# Altium project 智能锁实践教学平台.PrjPcb
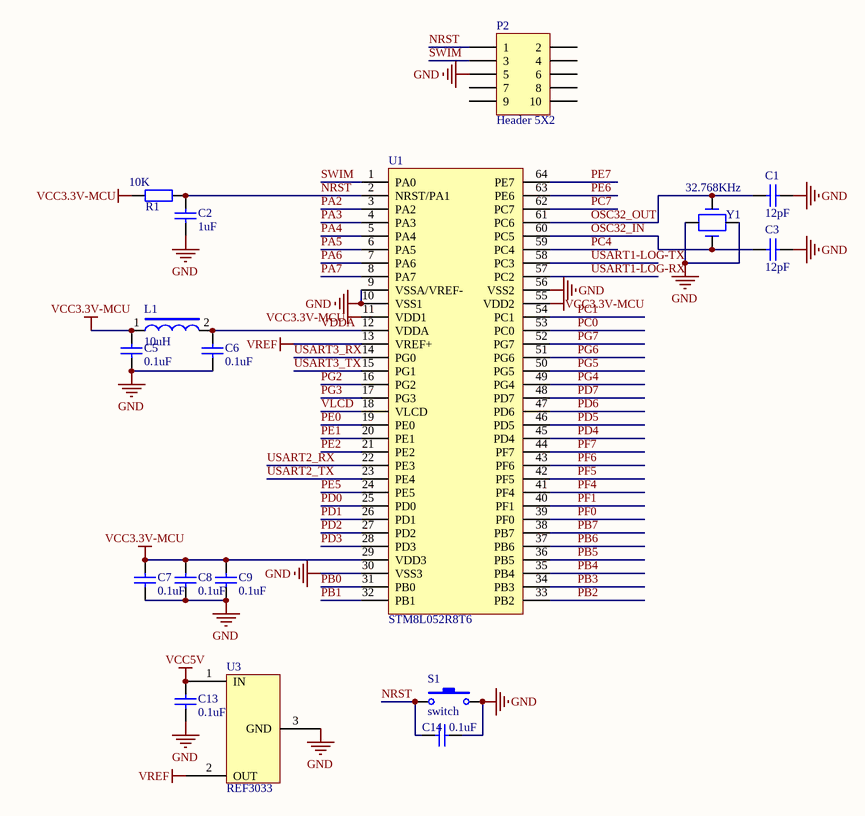
[diagram p0: core.SchDoc]
6 sheets, 194 parts. Net scope: global (net labels, ports and power ports of the same name join across sheets).
Board file: 智能锁实践教学平台.PcbDoc
Sheets:
  core.SchDoc
  interface.SchDoc
  usb.SchDoc
  monitor.SchDoc
  touch.SchDoc
  device.SchDoc

## Sheet core.SchDoc
size A4

### Parts
C1  12pF  [0603_C]
C2  1uF  [0603_C]
C3  12pF  [0603_C]
C5  0.1uF  [0603_C]
C6  0.1uF  [0603_C]
C7  0.1uF  [0603_C]
C8  0.1uF  [0603_C]
C9  0.1uF  [0603_C]
C13  0.1uF  [0603_C]
C14  0.1uF  [0603_C]
L1  10uH  [0603_L]
P2  Header 5X2  [2.54-2*5P简牛]
R1  10K  [0603_R]
S1  switch  [SW-SMD_4P-L6.2-W6.2-P4.50-LS9.0]
U1  STM8L052R8T6  [LQFP-64_10X10X05P]
U3  REF3033  [SOT-23(SOT-23-3)]
Y1  32.768KHz  [CRY_MC146]

### Nets
GND: C1.1 C2.1 C3.1 C5.1 C6.1 C7.1 C8.1 C9.1 C13.1 C14.2 P2.5 S1.2 U1.9(VSSA/VREF-) U1.10(VSS1) U1.30(VSS3) U1.56(VSS2) U3.3(GND) Y1.3 Y1.4
VCC3.3V-MCU: C5.2 C7.2 C8.2 C9.2 L1.1 R1.1 U1.11(VDD1) U1.29(VDD3) U1.55(VDD2)
VCC5V: C13.2 U3.1(IN)
VREF: U1.13(VREF+) U3.2(OUT)
NRST: C2.2 C14.1 P2.1 R1.2 S1.1 U1.2(NRST/PA1)
OSC32_IN: C3.2 U1.60(PC5) Y1.1
OSC32_OUT: C1.2 U1.61(PC6) Y1.2
PA2: U1.3(PA2)
PA3: U1.4(PA3)
PA4: U1.5(PA4)
PA5: U1.6(PA5)
PA6: U1.7(PA6)
PA7: U1.8(PA7)
PB0: U1.31(PB0)
PB1: U1.32(PB1)
PB2: U1.33(PB2)
PB3: U1.34(PB3)
PB4: U1.35(PB4)
PB5: U1.36(PB5)
PB6: U1.37(PB6)
PB7: U1.38(PB7)
PC0: U1.53(PC0)
PC1: U1.54(PC1)
PC4: U1.59(PC4)
PC7: U1.62(PC7)
PD0: U1.25(PD0)
PD1: U1.26(PD1)
PD2: U1.27(PD2)
PD3: U1.28(PD3)
PD4: U1.45(PD4)
PD5: U1.46(PD5)
PD6: U1.47(PD6)
PD7: U1.48(PD7)
PE0: U1.19(PE0)  [project net BiovoV9-INT]
PE1: U1.20(PE1)
PE2: U1.21(PE2)
PE5: U1.24(PE5)
PE6: U1.63(PE6)
PE7: U1.64(PE7)
PF0: U1.39(PF0)
PF1: U1.40(PF1)
PF4: U1.41(PF4)
PF5: U1.42(PF5)
PF6: U1.43(PF6)
PF7: U1.44(PF7)
PG2: U1.16(PG2)
PG3: U1.17(PG3)  [project net F1020-INT]
PG4: U1.49(PG4)
PG5: U1.50(PG5)
PG6: U1.51(PG6)
PG7: U1.52(PG7)
SWIM: P2.3 U1.1(PA0)
USART1-LOG-RX: U1.57(PC2)
USART1-LOG-TX: U1.58(PC3)
USART2_RX: U1.22(PE3)
USART2_TX: U1.23(PE4)
USART3_RX: U1.14(PG0)
USART3_TX: U1.15(PG1)
VDDA: C6.2 L1.2 U1.12(VDDA)
VLCD: U1.18(VLCD)

Not connected (* = marked no-connect by the designer): P2 2 4 6 7 8 9 10

### Library data of the parts
C1-C3 C5-C9 C13 C14 = Cap: 贴片电容，0603
L1 = L: MLZ1608E100MT000，贴片电感，0603
P2 = Header 5X2: 2.54mm 2*5P 直 简牛
R1 = Res2: 贴片电阻，0603
S1 = switch: 贴片按键，6*6*5
U1 = STM8L052R8T6: STM8L052R8T6,LQFP-64_10x10x05P
U3 = REF3033AIDBZR: 3.0V标准电压输出，SOT-23; autor: caibin
Y1 = CRYSTAL_1: OSC,32.768KHz,+/-25ppm,3.3V,15pF,MC146,-20℃~70℃

## Sheet interface.SchDoc
size A4
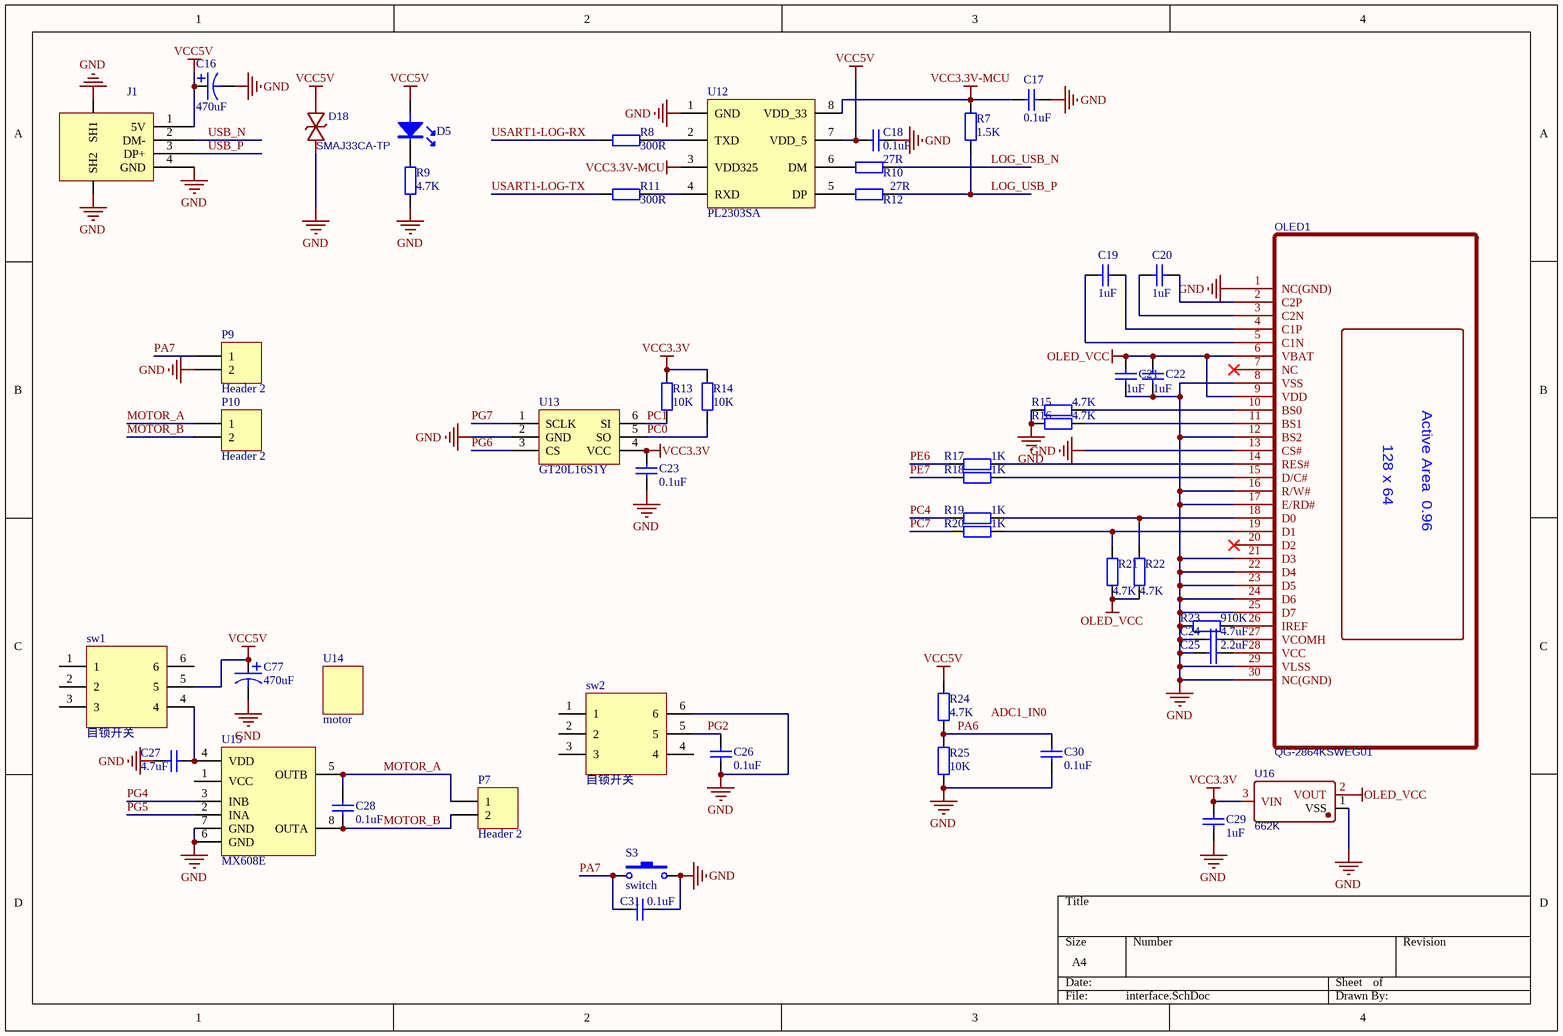
[diagram p1: interface.SchDoc]

### Parts
C16  470uF  [CAP-SMD_BD10.0-L10.3-W10.3-FD]
C17  0.1uF  [0603_C]
C18  0.1uF  [0603_C]
C19  1uF  [0603_C]
C20  1uF  [0603_C]
C21  1uF  [0603_C]
C22  1uF  [0603_C]
C23  0.1uF  [0603_C]
C24  4.7uF  [0603_C]
C25  2.2uF  [0603_C]
C26  0.1uF  [0603_C]
C27  4.7uF  [0603_C]
C28  0.1uF  [0603_C]
C29  1uF  [0603_C]
C30  0.1uF  [0603_C]
C31  0.1uF  [0603_C]
C77  470uF  [CAP-SMD_BD10.0-L10.3-W10.3-FD]
D5  LED  [0603_LED_S1]  (value not drawn)
D18  SMAJ33CA-TP  [SMA_L4.4-W2.6-LS5.0-BI]
J1  USB接口  [USB_D]  (value not drawn)
OLED1  QG-2864KSWEG01  [OLED-SMD_QG-2864KSWEG01-flod]
P7  Header 2  [HDR1X2]
P9  Header 2  [CONN-TH_WJ126V-5.0-2P]
P10  Header 2  [CONN-TH_WJ126V-5.0-2P]
R7  1.5K  [0603_R]
R8  300R  [0603_R]
R9  4.7K  [0603_R]
R10  27R  [0603_R]
R11  300R  [0603_R]
R12  27R  [0603_R]
R13  10K  [0603_R]
R14  10K  [0603_R]
R15  4.7K  [0603_R]
R16  4.7K  [0603_R]
R17  1K  [0603_R]
R18  1K  [0603_R]
R19  1K  [0603_R]
R20  1K  [0603_R]
R21  4.7K  [0603_R]
R22  4.7K  [0603_R]
R23  910K  [0603_R]
R24  4.7K  [0603_R]
R25  10K  [0603_R]
S3  switch  [SW-SMD_4P-L6.2-W6.2-P4.50-LS9.0]
sw1  自锁开关  [SW-TH_6P-L8.5-W8.5-P2.50-LS5.4-BL]
sw2  自锁开关  [SW-TH_6P-L8.5-W8.5-P2.50-LS5.4-BL]
U12  PL2303SA  [SOP-8_150mil]
U13  GT20L16S1Y  [SOT-23-6]
U14  motor  [MH-JS030LK140]
U15  MX608E  [SOP-8_150mil]
U16  662K  [SOT-23(SOT-23-3)]

### Nets
GND: C16.2 C17.1 C18.2 C21.2 C22.2 C23.1 C24.1 C25.1 C26.1 C27.1 C29.2 C30.1 C31.2 C77.2 D18.1 J1.4(GND) J1.SH1 J1.SH2 OLED1.1(NC(GND)) OLED1.8(VSS) OLED1.12(BS2) OLED1.13(CS#) OLED1.16(R/W#) OLED1.17(E/RD#) OLED1.21(D3) OLED1.22(D4) OLED1.23(D5) OLED1.24(D6) OLED1.25(D7) OLED1.29(VLSS) OLED1.30(NC(GND)) P9.2 R9.2 R15.1 R16.1 R23.2 R25.1 S3.2 sw2.6 U12.1(GND) U13.2(GND) U15.6(GND) U15.7(GND) U16.1(VSS)
OLED_VCC: C21.1 C22.1 OLED1.6(VBAT) OLED1.9(VDD) R21.1 R22.1 U16.2(VOUT)
VCC3.3V: C23.2 C29.1 R13.2 R14.2 U13.4(VCC) U16.3(VIN)
VCC3.3V-MCU: C17.2 R7.2 U12.3(VDD325) U12.8(VDD_33)
VCC5V: C16.1 C18.1 C77.1 D5.A D18.2 J1.1(5V) R24.2 sw1.5 U12.7(VDD_5)
LOG_USB_N: R10.2
LOG_USB_P: R7.1 R12.2
MOTOR_A: C28.1 P7.1 P10.1 U15.5(OUTB)
MOTOR_B: C28.2 P7.2 P10.2 U15.8(OUTA)
PA6: C30.2 R24.1 R25.2
PA7: C31.1 P9.1 S3.1
PC0: R14.1 U13.5(SO)
PC1: R13.1 U13.6(SI)
PC4: R19.1
PC7: R20.1
PE6: R17.1
PE7: R18.1
PG2: C26.2 sw2.5
PG4: U15.3(INB)
PG5: U15.2(INA)
PG6: U13.3(CS)
PG7: U13.1(SCLK)
USART1-LOG-RX: R8.1
USART1-LOG-TX: R11.1
USB_N: J1.2(DM-)
USB_P: J1.3(DP+)
NetC19_1: C19.1 OLED1.4(C1P)
NetC19_2: C19.2 OLED1.5(C1N)
NetC20_1: C20.1 OLED1.2(C2P)
NetC20_2: C20.2 OLED1.3(C2N)
NetC24_2: C24.2 OLED1.27(VCOMH)
NetC25_2: C25.2 OLED1.28(VCC)
NetC27_2: C27.2 sw1.4 U15.4(VDD)
NetD5_K: D5.K R9.1
NetOLED1_10: OLED1.10(BS0) R15.2
NetOLED1_11: OLED1.11(BS1) R16.2
NetOLED1_14: OLED1.14(RES#) R17.2
NetOLED1_15: OLED1.15(D/C#) R18.2
NetOLED1_18: OLED1.18(D0) R19.2 R22.2
NetOLED1_19: OLED1.19(D1) R20.2 R21.2
NetOLED1_26: OLED1.26(IREF) R23.1
NetR8_2: R8.2 U12.2(TXD)
NetR10_1: R10.1 U12.6(DM)
NetR11_2: R11.2 U12.4(RXD)
NetR12_1: R12.1 U12.5(DP)

Not connected (* = marked no-connect by the designer): OLED1 7(NC)* 20(D2)*; sw1 1 2 3 6; sw2 1 2 3 4; U15 1(VCC)

### Notes on the sheet
- Labels drawn without touching a wire or pin: ADC1_IN0
- (in symbol QG-2864KSWEG01) Active Area  0.96; 128 x 64

### Library data of the parts
C16 C77 = CAPACITOR: 贴片电容，1206
C17-C31 = Cap: 贴片电容，0603
D5 = LED: 贴片LED，0603，白色
D18 = SMAJ33CA-TP: TVS
J1 = USB: USB-B10-BRW
OLED1 = QG-2864KSWEG01: 128x64 单色白色，QG-2864KSWEG01; BOM_Manufacturer: Allvision; BOM_Supplier: LCSC; BOM_Manufacturer Part: QG-2864KSWEG01; BOM_Supplier Part: C85007; spicePre: O; spiceSymbolName: QG-2864KSWEG01
P7 = Header 2: 不焊; LatestRevisionDate: 17-Jul-2002; LatestRevisionNote: Re-released for DXP Platform.; Publisher: Altium Limited
P9 P10 = Header 2: WJ126V-5.0-2P，不焊
R7-R25 = Res2: 贴片电阻，0603
S3 = switch: 贴片按键，6*6*5
sw1 sw2 = switch_lock: 8.5*8.5*H22.35自锁按键开关
U12 = PL2303SA: USB转TTL芯片，PL2303SA，SOP-8_150mil
U13 = GT20L16S1Y: 字库芯片， SOT-23-6
U14 = motor: 顶呱呱工厂 MH-JS030LK140
U15 = MX608E: MX608E电机驱动，SOP8
U16 = 662K: 线性稳压器662k,SOT23-3

## Sheet usb.SchDoc
size A4
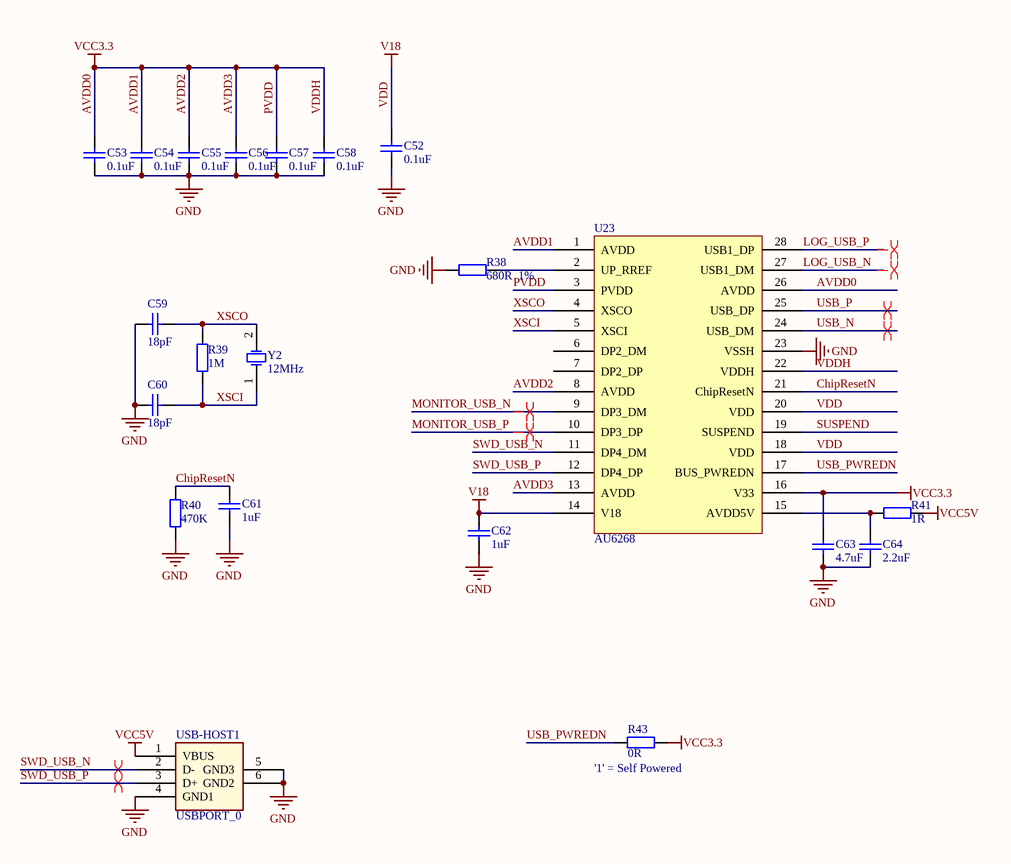
[diagram p2: usb.SchDoc]

### Parts
C52  0.1uF  [0603_C]
C53  0.1uF  [0603_C]
C54  0.1uF  [0603_C]
C55  0.1uF  [0603_C]
C56  0.1uF  [0603_C]
C57  0.1uF  [0603_C]
C58  0.1uF  [0603_C]
C59  18pF  [0603_C]
C60  18pF  [0603_C]
C61  1uF  [0603_C]
C62  1uF  [0603_C]
C63  4.7uF  [0603_C]
C64  2.2uF  [0603_C]
R38  680R  1%  [0603_R]
R39  1M  [0603_R]
R40  470K  [0603_R]
R41  1R  [0603_R]
R43  0R  [0603_R]
U23  AU6268  [SSOP-28_208mil]
USB-HOST1  USBPORT_0  [USB-A-TH_USB-DIP-04F-S1-B1-Y2]
Y2  12MHz  [LC-HC-49SMD]

### Nets
AVDD0: C53.2 C54.2 C55.2 C56.2 C57.2 C58.2 C63.2 R43.1 U23.1(AVDD) U23.3(PVDD) U23.8(AVDD) U23.13(AVDD) U23.16(V33) U23.22(VDDH) U23.26(AVDD)  [also labelled AVDD1, AVDD2, AVDD3, PVDD, VCC3.3, VDDH]
GND: C52.1 C53.1 C54.1 C55.1 C56.1 C57.1 C58.1 C59.2 C60.2 C61.1 C62.1 C63.1 C64.1 R38.1 R40.1 U23.23(VSSH) USB-HOST1.4(GND1) USB-HOST1.5(GND3) USB-HOST1.6(GND2)
VCC5V: R41.2 USB-HOST1.1(VBUS)
VDD: C52.2 C62.2 U23.14(V18) U23.18(VDD) U23.20(VDD)  [also labelled V18]
ChipResetN: C61.2 R40.2 U23.21(ChipResetN)
LOG_USB_N: U23.27(USB1_DM)
LOG_USB_P: U23.28(USB1_DP)
MONITOR_USB_N: U23.9(DP3_DM)
MONITOR_USB_P: U23.10(DP3_DP)
SUSPEND: U23.19(SUSPEND)
SWD_USB_N: U23.11(DP4_DM) USB-HOST1.2(D-)
SWD_USB_P: U23.12(DP4_DP) USB-HOST1.3(D+)
USB_N: U23.24(USB_DM)
USB_P: U23.25(USB_DP)
USB_PWREDN: R43.2 U23.17(BUS_PWREDN)
XSCI: C60.1 R39.1 U23.5(XSCI) Y2.1(OSC1)
XSCO: C59.1 R39.2 U23.4(XSCO) Y2.2(OSC2)
NetC64_2: C64.2 R41.1 U23.15(AVDD5V)
NetR38_2: R38.2 U23.2(UP_RREF)

Not connected (* = marked no-connect by the designer): U23 6(DP2_DM) 7(DP2_DP)

### Layout directives
differential pair: LOG_USB_N, LOG_USB_P, MONITOR_USB_N, MONITOR_USB_P, SWD_USB_N, SWD_USB_P, USB_N, USB_P

### Notes on the sheet
- (near R43) '1' = Self Powered

### Library data of the parts
C52-C64 = Cap: 贴片电容，0603
R38-R41 R43 = Res2: 贴片电阻，0603
U23 = AU6268: AU6268,SSOP28封装
USB-HOST1 = USBPORT_0: USB - A 插座 ,直角,292303-1
Y2 = XTAL: 贴片晶振，49SMD

## Sheet monitor.SchDoc
size A4
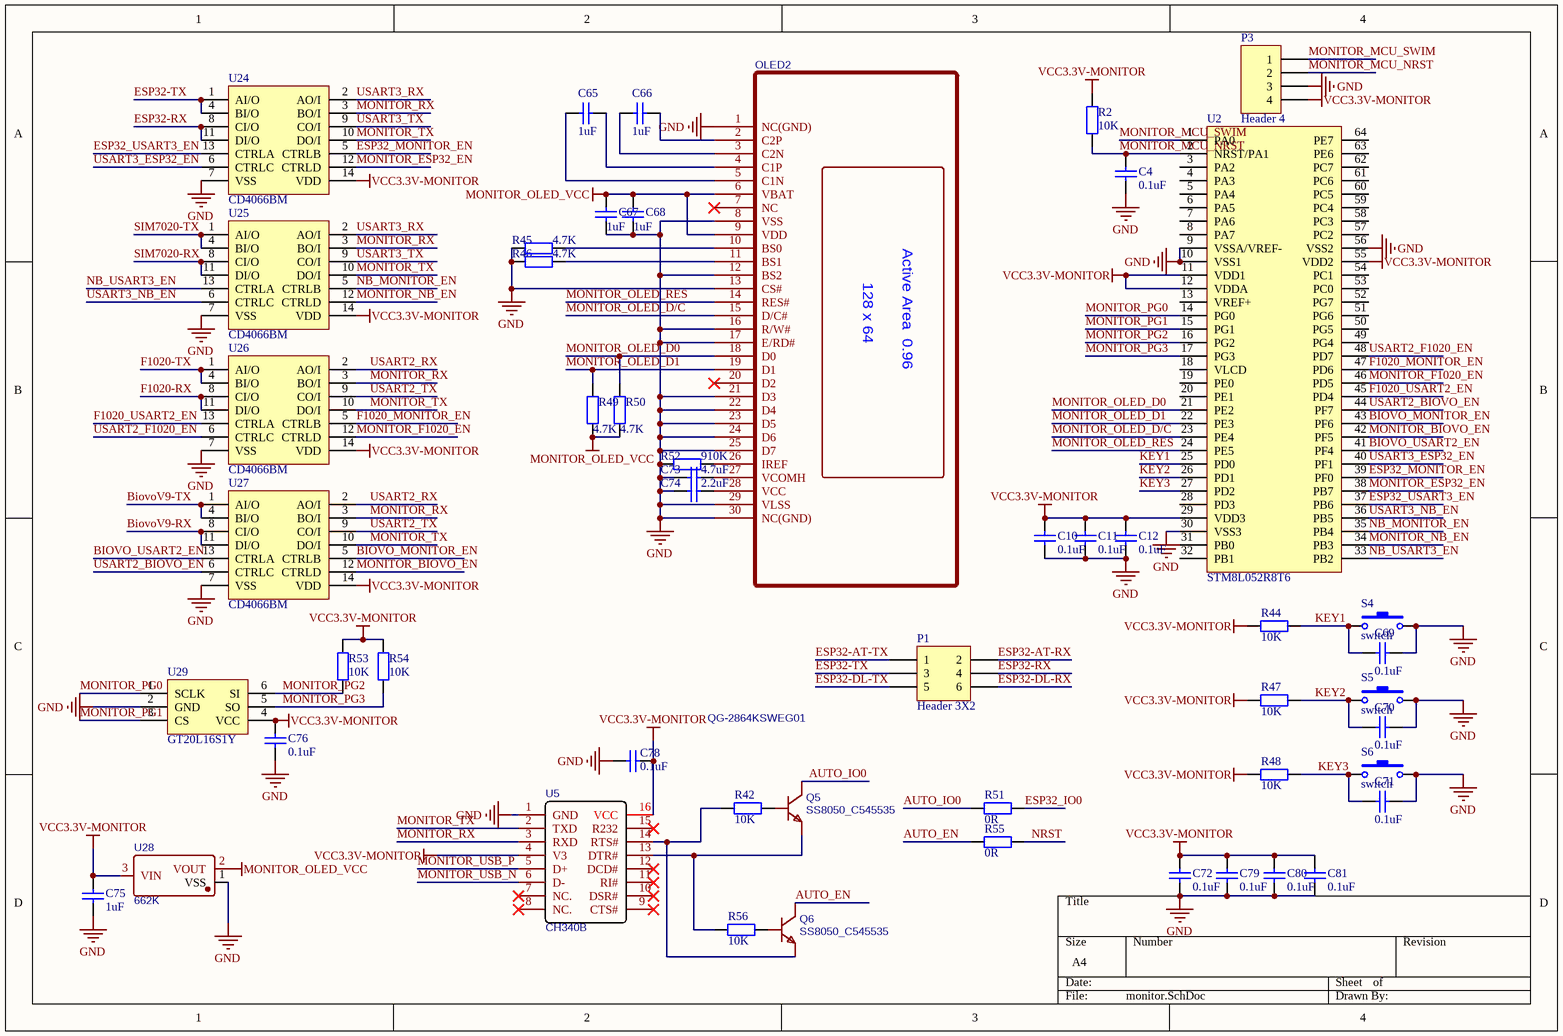
[diagram p3: monitor.SchDoc]

### Parts
C4  0.1uF  [0603_C]
C10  0.1uF  [0603_C]
C11  0.1uF  [0603_C]
C12  0.1uF  [0603_C]
C65  1uF  [0603_C]
C66  1uF  [0603_C]
C67  1uF  [0603_C]
C68  1uF  [0603_C]
C69  0.1uF  [0603_C]
C70  0.1uF  [0603_C]
C71  0.1uF  [0603_C]
C72  0.1uF  [0603_C]
C73  4.7uF  [0603_C]
C74  2.2uF  [0603_C]
C75  1uF  [0603_C]
C76  0.1uF  [0603_C]
C78  0.1uF  [0603_C]
C79  0.1uF  [0603_C]
C80  0.1uF  [0603_C]
C81  0.1uF  [0603_C]
OLED2  QG-2864KSWEG01  [OLED-SMD_QG-2864KSWEG01-flod]
P1  Header 3X2  [HDR2X3]
P3  Header 4  [HDR1X4]
Q5  SS8050_C545535  [SOT-23-3_L2.9-W1.3-P1.90-LS2.4-BR]
Q6  SS8050_C545535  [SOT-23-3_L2.9-W1.3-P1.90-LS2.4-BR]
R2  10K  [0603_R]
R42  10K  [0603_R]
R44  10K  [0603_R]
R45  4.7K  [0603_R]
R46  4.7K  [0603_R]
R47  10K  [0603_R]
R48  10K  [0603_R]
R49  4.7K  [0603_R]
R50  4.7K  [0603_R]
R51  0R  [0603_R]
R52  910K  [0603_R]
R53  10K  [0603_R]
R54  10K  [0603_R]
R55  0R  [0603_R]
R56  10K  [0603_R]
S4  switch  [SW-SMD_4P-L6.2-W6.2-P4.50-LS9.0]
S5  switch  [SW-SMD_4P-L6.2-W6.2-P4.50-LS9.0]
S6  switch  [SW-SMD_4P-L6.2-W6.2-P4.50-LS9.0]
U2  STM8L052R8T6  [LQFP-64_10X10X05P]
U5  CH340B  [SOP-16_L10.0-W3.9-P1.27-LS6.0-BL]
U24  CD4066BM  [SOIC-14_L8.7-W3.9-P1.27-LS6.0-BL]
U25  CD4066BM  [SOIC-14_L8.7-W3.9-P1.27-LS6.0-BL]
U26  CD4066BM  [SOIC-14_L8.7-W3.9-P1.27-LS6.0-BL]
U27  CD4066BM  [SOIC-14_L8.7-W3.9-P1.27-LS6.0-BL]
U28  662K  [SOT-23(SOT-23-3)]
U29  GT20L16S1Y  [SOT-23-6]

### Nets
GND: C4.1 C10.1 C11.1 C12.1 C67.2 C68.2 C69.1 C70.1 C71.1 C72.1 C73.1 C74.1 C75.2 C76.1 C78.1 C79.1 C80.1 C81.1 OLED2.1(NC(GND)) OLED2.8(VSS) OLED2.12(BS2) OLED2.13(CS#) OLED2.16(R/W#) OLED2.17(E/RD#) OLED2.21(D3) OLED2.22(D4) OLED2.23(D5) OLED2.24(D6) OLED2.25(D7) OLED2.29(VLSS) OLED2.30(NC(GND)) P3.3 R45.1 R46.1 R52.2 S4.2 S5.2 S6.2 U2.9(VSSA/VREF-) U2.10(VSS1) U2.30(VSS3) U2.56(VSS2) U5.1(GND) U24.7(VSS) U25.7(VSS) U26.7(VSS) U27.7(VSS) U28.1(VSS) U29.2(GND)
MONITOR_OLED_VCC: C67.1 C68.1 OLED2.6(VBAT) OLED2.9(VDD) R49.1 R50.1 U28.2(VOUT)
VCC3.3V-MONITOR: C10.2 C11.2 C12.2 C72.2 C75.1 C76.2 C78.2 C79.2 C80.2 C81.2 P3.4 R2.2 R44.2 R47.2 R48.2 R53.2 R54.2 U2.11(VDD1) U2.12(VDDA) U2.29(VDD3) U2.55(VDD2) U5.4(V3) U5.16(VCC) U24.14(VDD) U25.14(VDD) U26.14(VDD) U27.14(VDD) U28.3(VIN) U29.4(VCC)
AUTO_EN: Q6.3(C) R55.2
AUTO_IO0: Q5.3(C) R51.2
BIOVO_MONITOR_EN: U2.43(PF6) U27.5(CTRLB)
BIOVO_USART2_EN: U2.41(PF4) U27.13(CTRLA)
BiovoV9-RX: U27.8(CI/O) U27.11(DI/O)
BiovoV9-TX: U27.1(AI/O) U27.4(BI/O)
ESP32-AT-RX: P1.2
ESP32-AT-TX: P1.1
ESP32-DL-RX: P1.6
ESP32-DL-TX: P1.5
ESP32-RX: P1.4 U24.8(CI/O) U24.11(DI/O)
ESP32-TX: P1.3 U24.1(AI/O) U24.4(BI/O)
ESP32_IO0: R51.1
ESP32_MONITOR_EN: U2.39(PF0) U24.5(CTRLB)
ESP32_USART3_EN: U2.37(PB6) U24.13(CTRLA)
F1020-RX: U26.8(CI/O) U26.11(DI/O)
F1020-TX: U26.1(AI/O) U26.4(BI/O)
F1020_MONITOR_EN: U2.47(PD6) U26.5(CTRLB)
F1020_USART2_EN: U2.45(PD4) U26.13(CTRLA)
KEY1: C69.2 R44.1 S4.1 U2.25(PD0)
KEY2: C70.2 R47.1 S5.1 U2.26(PD1)
KEY3: C71.2 R48.1 S6.1 U2.27(PD2)
MONITOR_BIOVO_EN: U2.42(PF5) U27.12(CTRLD)
MONITOR_ESP32_EN: U2.38(PB7) U24.12(CTRLD)
MONITOR_F1020_EN: U2.46(PD5) U26.12(CTRLD)
MONITOR_MCU_NRST: C4.2 P3.2 R2.1 U2.2(NRST/PA1)
MONITOR_MCU_SWIM: P3.1 U2.1(PA0)
MONITOR_NB_EN: U2.34(PB3) U25.12(CTRLD)
MONITOR_OLED_D0: OLED2.18(D0) R50.2 U2.21(PE2)
MONITOR_OLED_D1: OLED2.19(D1) R49.2 U2.22(PE3)
MONITOR_OLED_D/C: OLED2.15(D/C#) U2.23(PE4)
MONITOR_OLED_RES: OLED2.14(RES#) U2.24(PE5)
MONITOR_PG0: U2.14(PG0) U29.1(SCLK)
MONITOR_PG1: U2.15(PG1) U29.3(CS)
MONITOR_PG2: R53.1 U2.16(PG2) U29.6(SI)
MONITOR_PG3: R54.1 U2.17(PG3) U29.5(SO)
MONITOR_RX: U5.3(RXD) U24.3(BO/I) U25.3(BO/I) U26.3(BO/I) U27.3(BO/I)
MONITOR_TX: U5.2(TXD) U24.10(DO/I) U25.10(DO/I) U26.10(DO/I) U27.10(DO/I)
MONITOR_USB_N: U5.6(D-)
MONITOR_USB_P: U5.5(D+)
NB_MONITOR_EN: U2.35(PB4) U25.5(CTRLB)
NB_USART3_EN: U2.33(PB2) U25.13(CTRLA)
NRST: R55.1
SIM7020-RX: U25.8(CI/O) U25.11(DI/O)
SIM7020-TX: U25.1(AI/O) U25.4(BI/O)
USART2_BIOVO_EN: U2.44(PF7) U27.6(CTRLC)
USART2_F1020_EN: U2.48(PD7) U26.6(CTRLC)
USART2_RX: U26.2(AO/I) U27.2(AO/I)
USART2_TX: U26.9(CO/I) U27.9(CO/I)
USART3_ESP32_EN: U2.40(PF1) U24.6(CTRLC)
USART3_NB_EN: U2.36(PB5) U25.6(CTRLC)
USART3_RX: U24.2(AO/I) U25.2(AO/I)
USART3_TX: U24.9(CO/I) U25.9(CO/I)
NetC65_1: C65.1 OLED2.4(C1P)
NetC65_2: C65.2 OLED2.5(C1N)
NetC66_1: C66.1 OLED2.2(C2P)
NetC66_2: C66.2 OLED2.3(C2N)
NetC73_2: C73.2 OLED2.27(VCOMH)
NetC74_2: C74.2 OLED2.28(VCC)
NetOLED2_10: OLED2.10(BS0) R45.2
NetOLED2_11: OLED2.11(BS1) R46.2
NetOLED2_26: OLED2.26(IREF) R52.1
NetQ5_1: Q5.1(B) R42.1
NetQ5_2: Q5.2(E) R56.2 U5.13(DTR#)
NetQ6_1: Q6.1(B) R56.1
NetQ6_2: Q6.2(E) R42.2 U5.14(RTS#)

Not connected (* = marked no-connect by the designer): OLED2 7(NC)* 20(D2)*; U2 3(PA2) 4(PA3) 5(PA4) 6(PA5) 7(PA6) 8(PA7) 13(VREF+) 18(VLCD) 19(PE0) 20(PE1) 28(PD3) 31(PB0) 32(PB1) 49(PG4) 50(PG5) 51(PG6) 52(PG7) 53(PC0) 54(PC1) 57(PC2) 58(PC3) 59(PC4) 60(PC5) 61(PC6) 62(PC7) 63(PE6) 64(PE7); U5 7(NC.)* 8(NC.)* 9(CTS#)* 10(DSR#)* 11(RI#)* 12(DCD#)* 15(R232)*

### Notes on the sheet
- (in symbol QG-2864KSWEG01) Active Area  0.96; 128 x 64

### Library data of the parts
C4 C10-C12 C65-C76 C78-C81 = Cap: 贴片电容，0603
OLED2 = QG-2864KSWEG01: as OLED1 on sheet interface; BOM_Supplier: LCSC; BOM_Manufacturer Part: QG-2864KSWEG01; BOM_Supplier Part: C85007; spicePre: O; spiceSymbolName: QG-2864KSWEG01
P1 = Header 3X2: Header, 3-Pin, Dual row; LatestRevisionDate: 17-Jul-2002; LatestRevisionNote: Re-released for DXP Platform.; Publisher: Altium Limited
P3 = Header 4: 不焊; LatestRevisionDate: 17-Jul-2002; LatestRevisionNote: Re-released for DXP Platform.; Publisher: Altium Limited
Q5 Q6 = SS8050_C545535: S8050,SOT-23
R2 R42 R44-R56 = Res2: 贴片电阻，0603
S4-S6 = switch: 贴片按键，6*6*5
U2 = STM8L052R8T6: STM8L052R8T6,LQFP-64_10x10x05P
U5 = CH340C: CH340B,SOP-16_150mil
U24-U27 = CD4066B: 双向 FET 开关,CD4066BM,SOIC-14
U28 = 662K: 线性稳压器662k,SOT23-3
U29 = GT20L16S1Y: 字库芯片， SOT-23-6

## Sheet touch.SchDoc
size A4
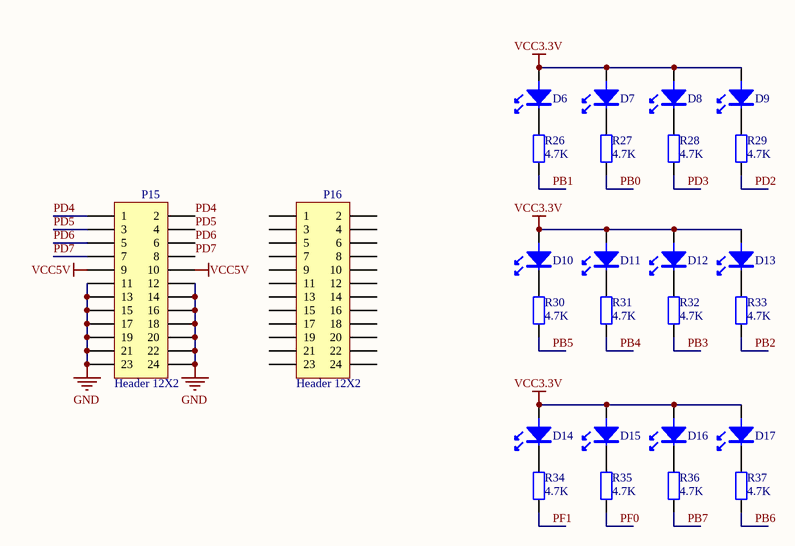
[diagram p4: touch.SchDoc]

### Parts
D6  LED  [0603_LED_S1]  (value not drawn)
D7  LED  [0603_LED_S1]  (value not drawn)
D8  LED  [0603_LED_S1]  (value not drawn)
D9  LED  [0603_LED_S1]  (value not drawn)
D10  LED  [0603_LED_S1]  (value not drawn)
D11  LED  [0603_LED_S1]  (value not drawn)
D12  LED  [0603_LED_S1]  (value not drawn)
D13  LED  [0603_LED_S1]  (value not drawn)
D14  LED  [0603_LED_S1]  (value not drawn)
D15  LED  [0603_LED_S1]  (value not drawn)
D16  LED  [0603_LED_S1]  (value not drawn)
D17  LED  [0603_LED_S1]  (value not drawn)
P15  Header 12X2  [2.0mm 2*12P直排母]
P16  Header 12X2  [2.0mm 2*12P直排母]
R26  4.7K  [0603_R]
R27  4.7K  [0603_R]
R28  4.7K  [0603_R]
R29  4.7K  [0603_R]
R30  4.7K  [0603_R]
R31  4.7K  [0603_R]
R32  4.7K  [0603_R]
R33  4.7K  [0603_R]
R34  4.7K  [0603_R]
R35  4.7K  [0603_R]
R36  4.7K  [0603_R]
R37  4.7K  [0603_R]

### Nets
GND: P15.11 P15.12 P15.13 P15.14 P15.15 P15.16 P15.17 P15.18 P15.19 P15.20 P15.21 P15.22 P15.23 P15.24
VCC3.3V: D6.A D7.A D8.A D9.A D10.A D11.A D12.A D13.A D14.A D15.A D16.A D17.A
VCC5V: P15.9 P15.10
PB0: R27.1
PB1: R26.1
PB2: R33.1
PB3: R32.1
PB4: R31.1
PB5: R30.1
PB6: R37.1
PB7: R36.1
PD2: R29.1
PD3: R28.1
PD4: P15.1 P15.2
PD5: P15.3 P15.4
PD6: P15.5 P15.6
PD7: P15.7 P15.8
PF0: R35.1
PF1: R34.1
NetD6_K: D6.K R26.2
NetD7_K: D7.K R27.2
NetD8_K: D8.K R28.2
NetD9_K: D9.K R29.2
NetD10_K: D10.K R30.2
NetD11_K: D11.K R31.2
NetD12_K: D12.K R32.2
NetD13_K: D13.K R33.2
NetD14_K: D14.K R34.2
NetD15_K: D15.K R35.2
NetD16_K: D16.K R36.2
NetD17_K: D17.K R37.2

Not connected (* = marked no-connect by the designer): P16 1 2 3 4 5 6 7 8 9 10 11 12 13 14 15 16 17 18 19 20 21 22 23 24

### Library data of the parts
D6-D17 = LED: 贴片LED，0603，白色
P15 P16 = Header 12X2: Header, 12-Pin, Dual row; LatestRevisionDate: 17-Jul-2002; LatestRevisionNote: Re-released for DXP Platform.; Publisher: Altium Limited
R26-R37 = Res2: 贴片电阻，0603

## Sheet device.SchDoc
size A4
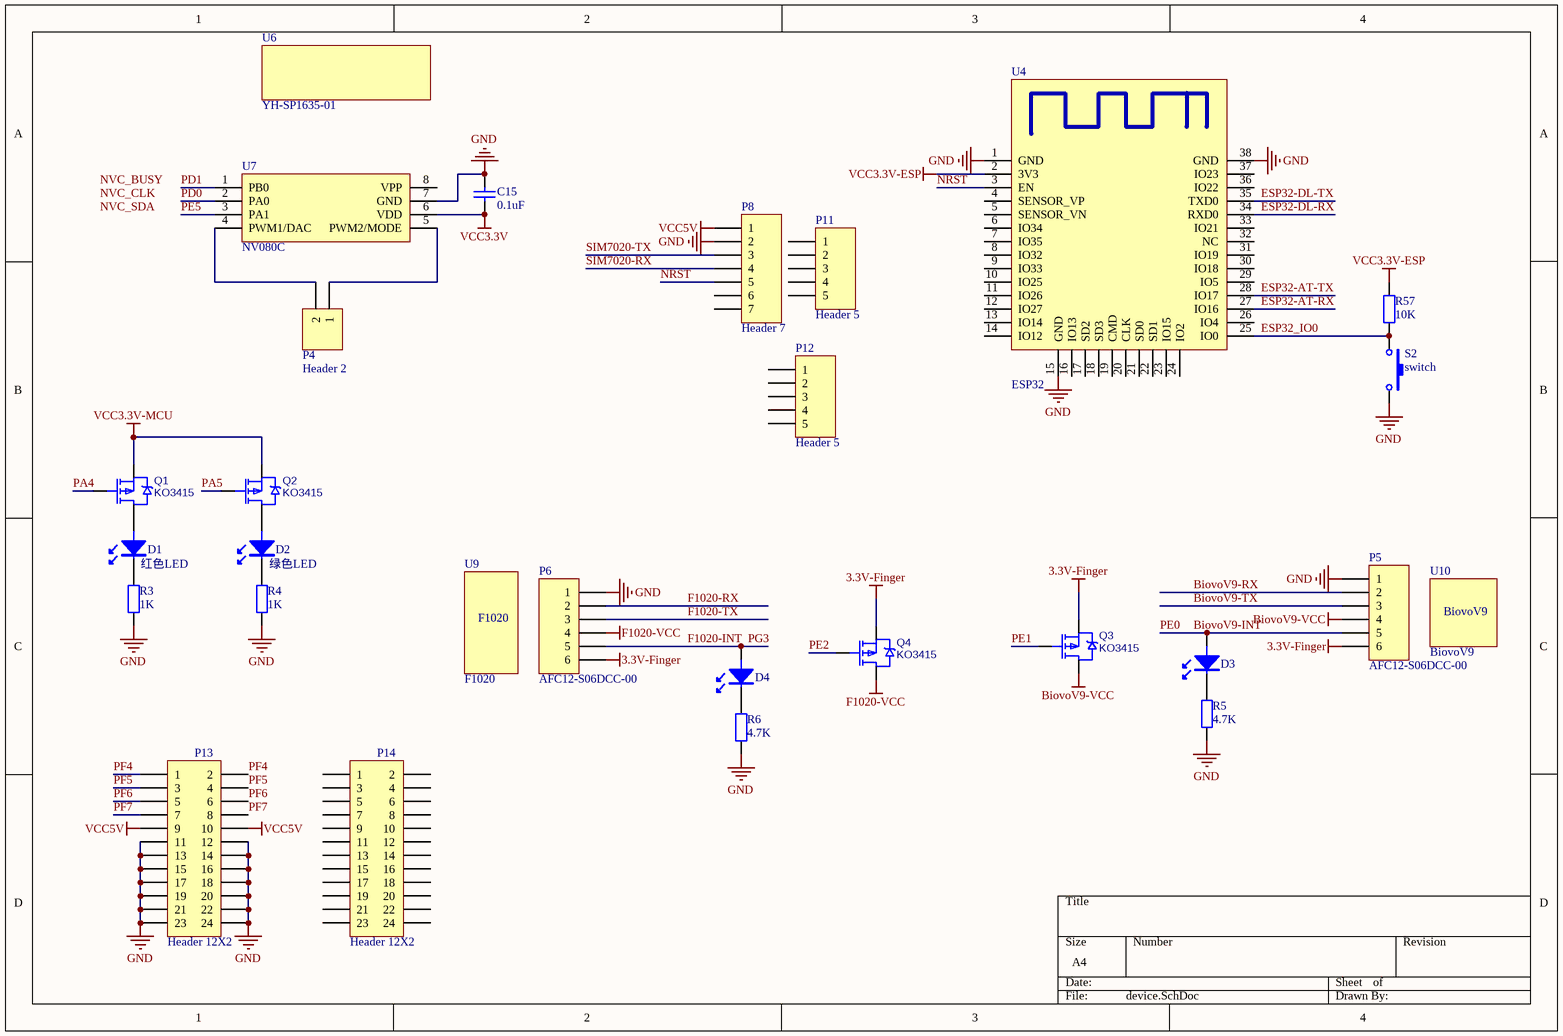
[diagram p5: device.SchDoc]

### Parts
C15  0.1uF  [0603_C]
D1  红色LED  [LED_1206]
D2  绿色LED  [LED_1206]
D3  LED  [0603_LED_S1]  (value not drawn)
D4  LED  [0603_LED_S1]  (value not drawn)
P4  Header 2  [HDR1X2]
P5  AFC12-S06DCC-00  [CONN-SMD_6PIN_AFC12-S06DCC-00_PITCH1.25-L]
P6  AFC12-S06DCC-00  [CONN-SMD_6PIN_AFC12-S06DCC-00_PITCH1.25-L]
P8  Header 7  [HDR1X7]
P11  Header 5  [HDR1X5]
P12  Header 5  [HDR1X5]
P13  Header 12X2  [2.0mm 2*12P直排母]
P14  Header 12X2  [2.0mm 2*12P直排母]
Q1  KO3415  [SOT-23(SOT-23-3)]
Q2  KO3415  [SOT-23(SOT-23-3)]
Q3  KO3415  [SOT-23(SOT-23-3)]
Q4  KO3415  [SOT-23(SOT-23-3)]
R3  1K  [0603_R]
R4  1K  [0603_R]
R5  4.7K  [0603_R]
R6  4.7K  [0603_R]
R57  10K  [0603_R]
S2  switch  [SW-SMD_4P-L6.2-W6.2-P4.50-LS9.0]
U4  ESP32  [WIFIM-SMD_ESP32-S32MB]
U6  YH-SP1635-01  [YH-SP1635-01]
U7  NV080C  [SOP-8_150mil]
U9  F1020  [F1020]
U10  BiovoV9  [BiovoV9]

### Nets
3.3V-Finger: P5.6 P6.6 Q3.2(S) Q4.2(S)
BiovoV9-VCC: P5.4 Q3.3(D)
F1020-VCC: P6.4 Q4.3(D)
GND: C15.2 P5.1 P6.1 P8.2 P13.11 P13.12 P13.13 P13.14 P13.15 P13.16 P13.17 P13.18 P13.19 P13.20 P13.21 P13.22 P13.23 P13.24 R3.1 R4.1 R5.1 R6.1 S2.2 U4.1(GND) U4.15(GND) U4.38(GND) U7.7(GND)
VCC3.3V: C15.1 U7.6(VDD)
VCC3.3V-ESP: R57.2 U4.2(3V3)
VCC3.3V-MCU: Q1.2(S) Q2.2(S)
VCC5V: P8.1 P13.9 P13.10
BiovoV9-INT: D3.A P5.5  [also labelled PE0]
BiovoV9-RX: P5.2
BiovoV9-TX: P5.3
ESP32-AT-RX: U4.27(IO16)
ESP32-AT-TX: U4.28(IO17)
ESP32-DL-RX: U4.34(RXD0)
ESP32-DL-TX: U4.35(TXD0)
ESP32_IO0: R57.1 S2.1 U4.25(IO0)
F1020-INT: D4.A P6.5  [also labelled PG3]
F1020-RX: P6.2
F1020-TX: P6.3
NRST: P8.5 U4.3(EN)
PA4: Q1.1(G)
PA5: Q2.1(G)
PD0: U7.2(PA0)
PD1: U7.1(PB0)
PE1: Q3.1(G)
PE2: Q4.1(G)
PE5: U7.3(PA1)
PF4: P13.1 P13.2
PF5: P13.3 P13.4
PF6: P13.5 P13.6
PF7: P13.7 P13.8
SIM7020-RX: P8.4
SIM7020-TX: P8.3
NetD1_A: D1.A Q1.3(D)
NetD1_K: D1.K R3.2
NetD2_A: D2.A Q2.3(D)
NetD2_K: D2.K R4.2
NetD3_K: D3.K R5.2
NetD4_K: D4.K R6.2
NetP4_1: P4.1 U7.5(PWM2/MODE)
NetP4_2: P4.2 U7.4(PWM1/DAC)

Not connected (* = marked no-connect by the designer): P8 6 7; P11 1 2 3 4 5; P12 1 2 3 4 5; P14 1 2 3 4 5 6 7 8 9 10 11 12 13 14 15 16 17 18 19 20 21 22 23 24; U4 4(SENSOR_VP) 5(SENSOR_VN) 6(IO34) 7(IO35) 8(IO32) 9(IO33) 10(IO25) 11(IO26) 12(IO27) 13(IO14) 14(IO12) 16(IO13) 17(SD2) 18(SD3) 19(CMD) 20(CLK) 21(SD0) 22(SD1) 23(IO15) 24(IO2) 26(IO4) 29(IO5) 30(IO18) 31(IO19) 32(NC) 33(IO21) 36(IO22) 37(IO23); U7 8(VPP)

### Notes on the sheet
- Labels drawn without touching a wire or pin: NVC_BUSY, NVC_CLK, NVC_SDA

### Library data of the parts
C15 = Cap: 贴片电容，0603
D1 = LED: 1206封装，红色LED
D2 = LED: 1206封装，绿色LED
D3 D4 = LED: 贴片LED，0603，白色
P4 = Header 2: 不焊; LatestRevisionDate: 17-Jul-2002; LatestRevisionNote: Re-released for DXP Platform.; Publisher: Altium Limited
P5 P6 = Header 6: 1.25MM 6P 卧式贴片插座连接器
P8 = Header 7: Header, 7-Pin; LatestRevisionDate: 17-Jul-2002; LatestRevisionNote: Re-released for DXP Platform.; Publisher: Altium Limited
P11 P12 = Header 5: Header, 5-Pin; LatestRevisionDate: 17-Jul-2002; LatestRevisionNote: Re-released for DXP Platform.; Publisher: Altium Limited
P13 P14 = Header 12X2: Header, 12-Pin, Dual row; LatestRevisionDate: 17-Jul-2002; LatestRevisionNote: Re-released for DXP Platform.; Publisher: Altium Limited
Q1-Q4 = 3415: KO3415,SOT23-3
R3-R6 R57 = Res2: 贴片电阻，0603
S2 = switch: 贴片按键，6*6*5
U6 = speaker: 1635腔体喇叭，不焊
U7 = NVCXXXC: 语音芯片，SOP-8
U9 = F1020: 不焊
U10 = BiovoV9: 不焊

## Nets that join several sheets
GND: core (19 pins), interface (44 pins), usb (19 pins), monitor (49 pins), touch (14 pins), device (27 pins)
VCC3.3V: interface (6 pins), touch (12 pins), device (C15.1 U7.6)
VCC3.3V-MCU: core (9 pins), interface (C17.2 R7.2 U12.3 U12.8), device (Q1.2 Q2.2)
VCC5V: core (C13.2 U3.1), interface (9 pins), usb (R41.2 USB-HOST1.1), touch (P15.9 P15.10), device (P8.1 P13.9 P13.10)
BiovoV9-INT: core (U1.19), device (D3.A P5.5)
BiovoV9-RX: monitor (U27.8 U27.11), device (P5.2)
BiovoV9-TX: monitor (U27.1 U27.4), device (P5.3)
ESP32-AT-RX: monitor (P1.2), device (U4.27)
ESP32-AT-TX: monitor (P1.1), device (U4.28)
ESP32-DL-RX: monitor (P1.6), device (U4.34)
ESP32-DL-TX: monitor (P1.5), device (U4.35)
ESP32_IO0: monitor (R51.1), device (R57.1 S2.1 U4.25)
F1020-INT: core (U1.17), device (D4.A P6.5)
F1020-RX: monitor (U26.8 U26.11), device (P6.2)
F1020-TX: monitor (U26.1 U26.4), device (P6.3)
LOG_USB_N: interface (R10.2), usb (U23.27)
LOG_USB_P: interface (R7.1 R12.2), usb (U23.28)
MONITOR_USB_N: usb (U23.9), monitor (U5.6)
MONITOR_USB_P: usb (U23.10), monitor (U5.5)
NRST: core (6 pins), monitor (R55.1), device (P8.5 U4.3)
PA4: core (U1.5), device (Q1.1)
PA5: core (U1.6), device (Q2.1)
PA6: core (U1.7), interface (C30.2 R24.1 R25.2)
PA7: core (U1.8), interface (C31.1 P9.1 S3.1)
PB0: core (U1.31), touch (R27.1)
PB1: core (U1.32), touch (R26.1)
PB2: core (U1.33), touch (R33.1)
PB3: core (U1.34), touch (R32.1)
PB4: core (U1.35), touch (R31.1)
PB5: core (U1.36), touch (R30.1)
PB6: core (U1.37), touch (R37.1)
PB7: core (U1.38), touch (R36.1)
PC0: core (U1.53), interface (R14.1 U13.5)
PC1: core (U1.54), interface (R13.1 U13.6)
PC4: core (U1.59), interface (R19.1)
PC7: core (U1.62), interface (R20.1)
PD0: core (U1.25), device (U7.2)
PD1: core (U1.26), device (U7.1)
PD2: core (U1.27), touch (R29.1)
PD3: core (U1.28), touch (R28.1)
PD4: core (U1.45), touch (P15.1 P15.2)
PD5: core (U1.46), touch (P15.3 P15.4)
PD6: core (U1.47), touch (P15.5 P15.6)
PD7: core (U1.48), touch (P15.7 P15.8)
PE1: core (U1.20), device (Q3.1)
PE2: core (U1.21), device (Q4.1)
PE5: core (U1.24), device (U7.3)
PE6: core (U1.63), interface (R17.1)
PE7: core (U1.64), interface (R18.1)
PF0: core (U1.39), touch (R35.1)
PF1: core (U1.40), touch (R34.1)
PF4: core (U1.41), device (P13.1 P13.2)
PF5: core (U1.42), device (P13.3 P13.4)
PF6: core (U1.43), device (P13.5 P13.6)
PF7: core (U1.44), device (P13.7 P13.8)
PG2: core (U1.16), interface (C26.2 sw2.5)
PG4: core (U1.49), interface (U15.3)
PG5: core (U1.50), interface (U15.2)
PG6: core (U1.51), interface (U13.3)
PG7: core (U1.52), interface (U13.1)
SIM7020-RX: monitor (U25.8 U25.11), device (P8.4)
SIM7020-TX: monitor (U25.1 U25.4), device (P8.3)
USART1-LOG-RX: core (U1.57), interface (R8.1)
USART1-LOG-TX: core (U1.58), interface (R11.1)
USART2_RX: core (U1.22), monitor (U26.2 U27.2)
USART2_TX: core (U1.23), monitor (U26.9 U27.9)
USART3_RX: core (U1.14), monitor (U24.2 U25.2)
USART3_TX: core (U1.15), monitor (U24.9 U25.9)
USB_N: interface (J1.2), usb (U23.24)
USB_P: interface (J1.3), usb (U23.25)